# Altium schematic sheet SENSOR.SchDoc
size 420 x 297 mm; SheetNumber: 4; SheetTotal: 4
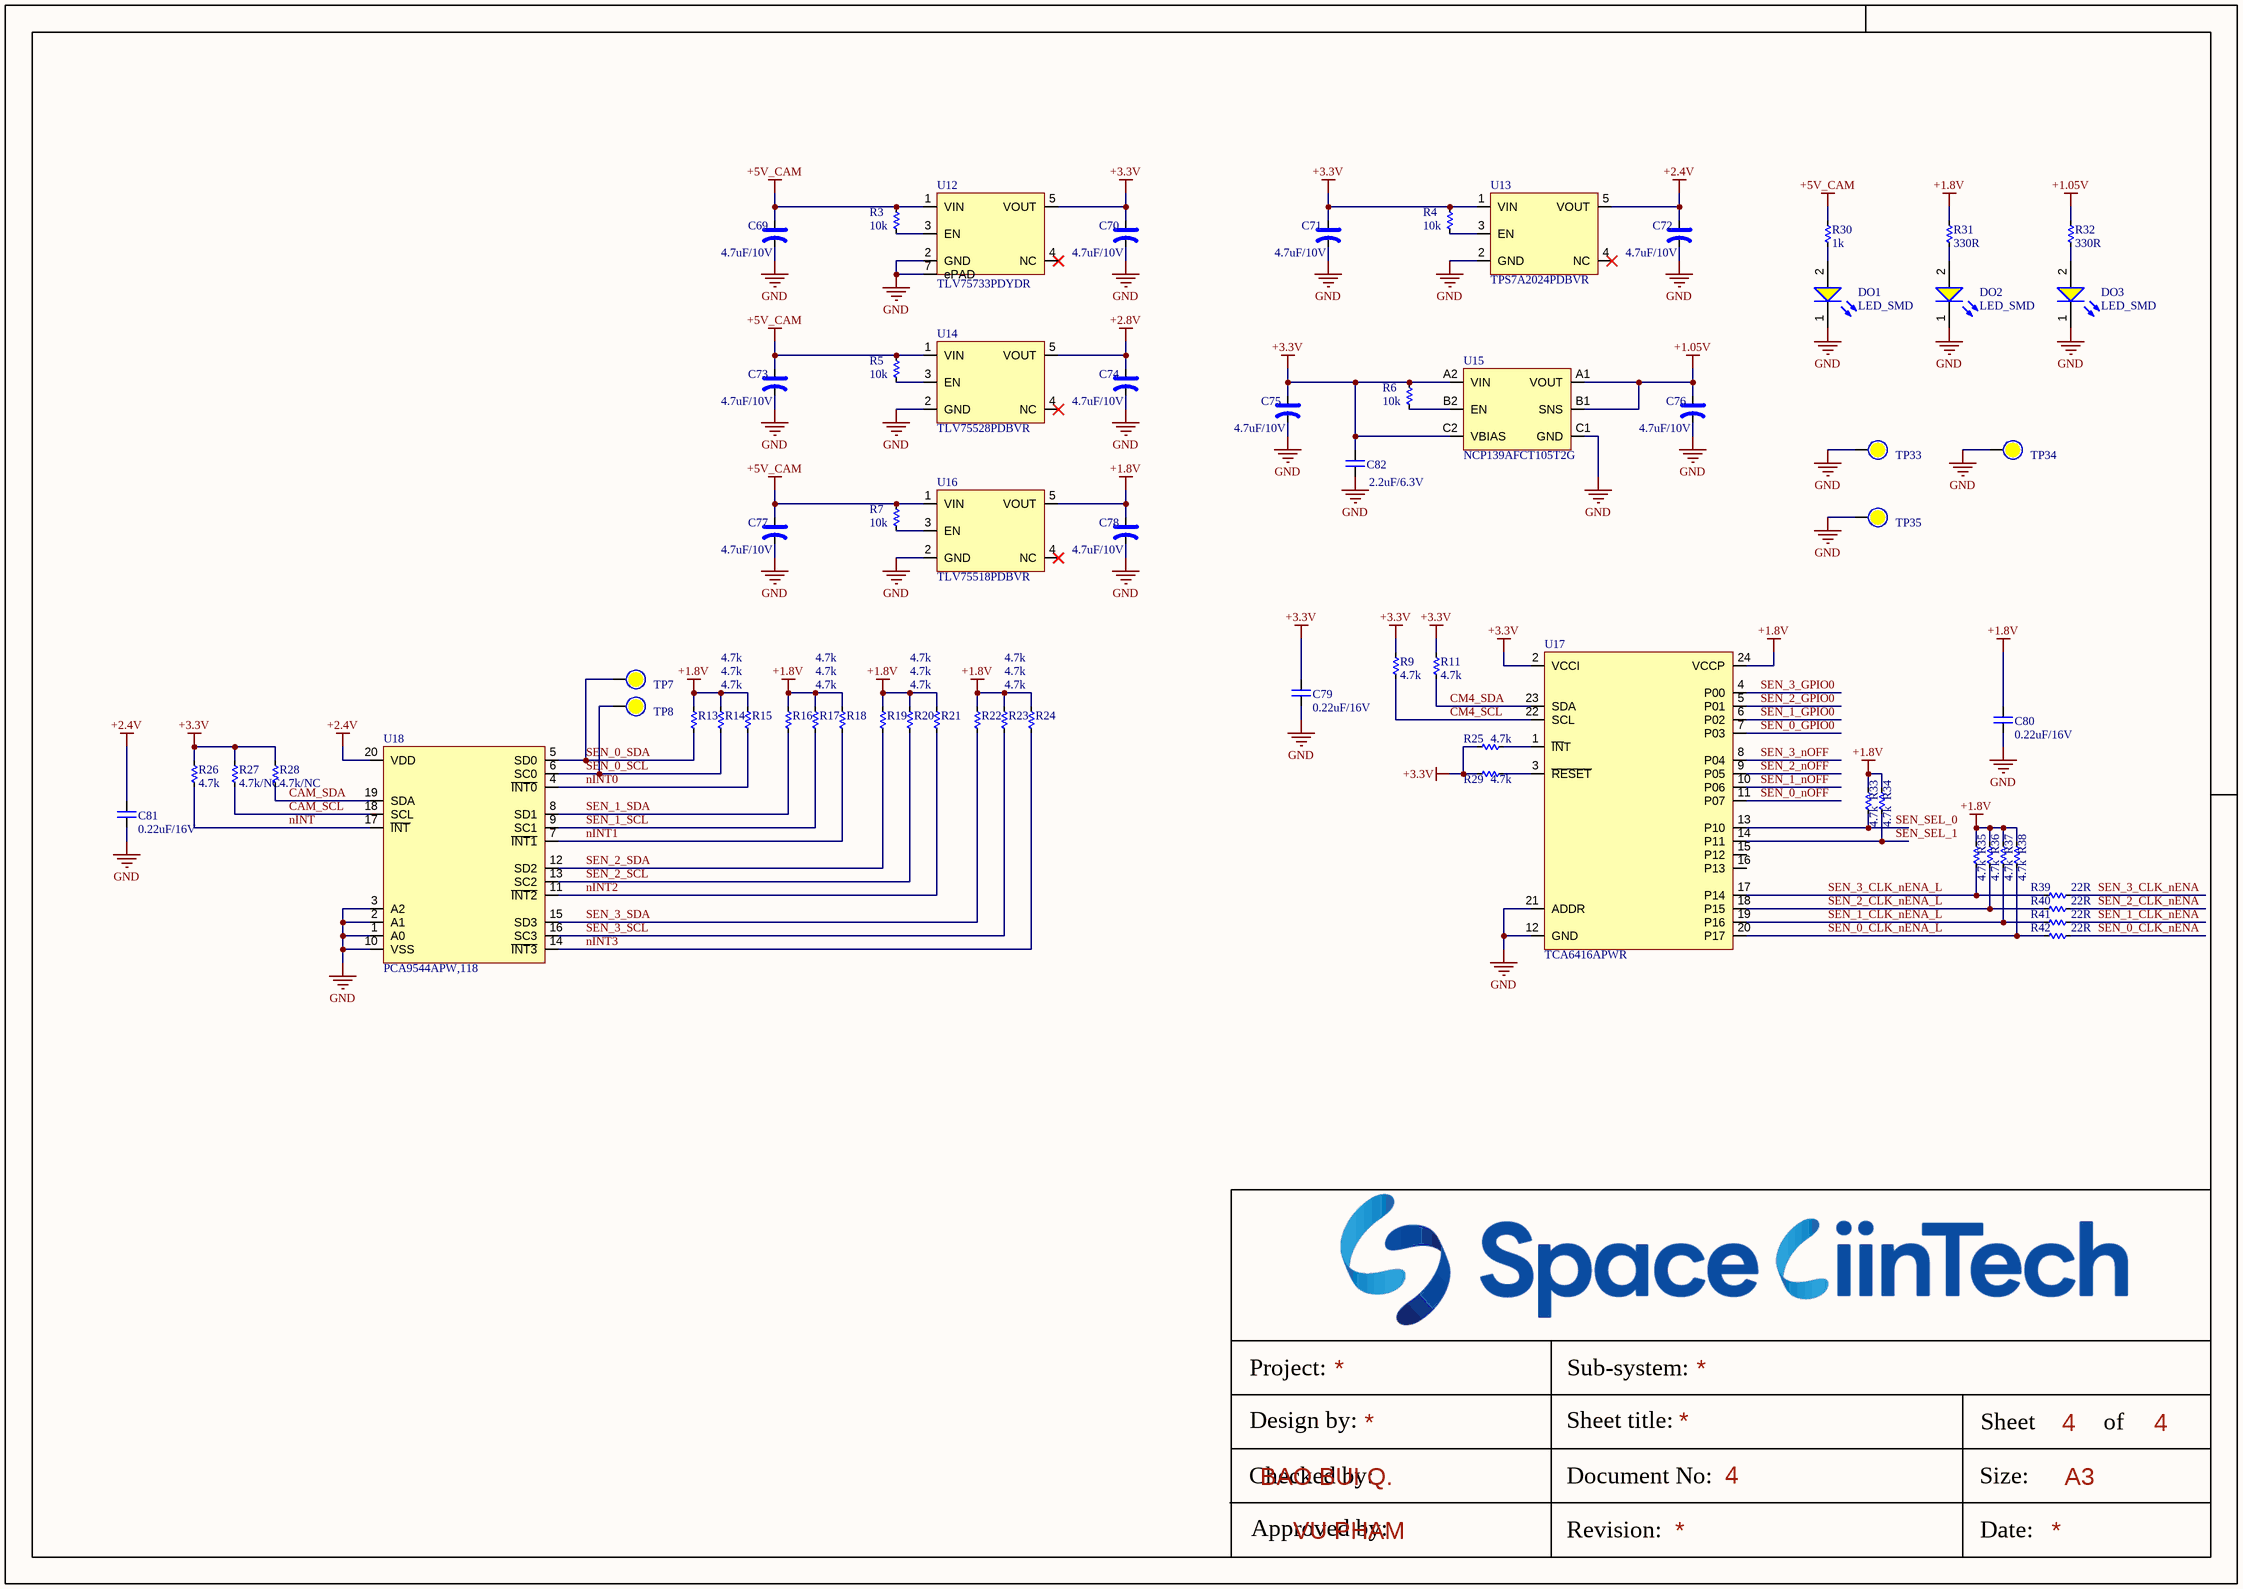
[diagram p0: SENSOR.SchDoc]

## Parts
C69  4.7uF/10V  [CAP_MP_1608X90]
C70  4.7uF/10V  [CAP_MP_1608X90]
C71  4.7uF/10V  [CAP_MP_1608X90]
C72  4.7uF/10V  [CAP_MP_1608X90]
C73  4.7uF/10V  [CAP_MP_1608X90]
C74  4.7uF/10V  [CAP_MP_1608X90]
C75  4.7uF/10V  [CAP_MP_1608X90]
C76  4.7uF/10V  [CAP_MP_1608X90]
C77  4.7uF/10V  [CAP_MP_1608X90]
C78  4.7uF/10V  [CAP_MP_1608X90]
C79  0.22uF/16V  [CAP_C_1005X60]
C80  0.22uF/16V  [CAP_C_1005X60]
C81  0.22uF/16V  [CAP_C_1005X60]
C82  2.2uF/6.3V  [CAP_C_1005X60]
DO1  LED_SMD  [LED_0603]
DO2  LED_SMD  [LED_0603]
DO3  LED_SMD  [LED_0603]
R3  10k  [RES_C_1005X40]
R4  10k  [RES_C_1005X40]
R5  10k  [RES_C_1005X40]
R6  10k  [RES_C_1005X40]
R7  10k  [RES_C_1005X40]
R9  4.7k  [RES_C_1005X40]
R11  4.7k  [RES_C_1005X40]
R13  4.7k  [RES_C_1005X40]
R14  4.7k  [RES_C_1005X40]
R15  4.7k  [RES_C_1005X40]
R16  4.7k  [RES_C_1005X40]
R17  4.7k  [RES_C_1005X40]
R18  4.7k  [RES_C_1005X40]
R19  4.7k  [RES_C_1005X40]
R20  4.7k  [RES_C_1005X40]
R21  4.7k  [RES_C_1005X40]
R22  4.7k  [RES_C_1005X40]
R23  4.7k  [RES_C_1005X40]
R24  4.7k  [RES_C_1005X40]
R25  4.7k  [RES_C_1005X40]
R26  4.7k  [RES_C_1005X40]
R27  4.7k/NC  [RES_C_1005X40]
R28  4.7k/NC  [RES_C_1005X40]
R29  4.7k  [RES_C_1005X40]
R30  1k  [RES_C_1005X40]
R31  330R  [RES_C_1005X40]
R32  330R  [RES_C_1005X40]
R33  4.7k  [RES_C_1005X40]
R34  4.7k  [RES_C_1005X40]
R35  4.7k  [RES_C_1005X40]
R36  4.7k  [RES_C_1005X40]
R37  4.7k  [RES_C_1005X40]
R38  4.7k  [RES_C_1005X40]
R39  22R  [RES_C_1005X40]
R40  22R  [RES_C_1005X40]
R41  22R  [RES_C_1005X40]
R42  22R  [RES_C_1005X40]
TP7  (no value)  [Testpoint_80]  (no BOM)
TP8  (no value)  [Testpoint_80]  (no BOM)
TP33  (no value)  [Testpoint_80]  (no BOM)
TP34  (no value)  [Testpoint_80]  (no BOM)
TP35  (no value)  [Testpoint_80]  (no BOM)
U12  TLV75733PDYDR  [SOT25-EPAD]
U13  TPS7A2024PDBVR  [SOT25]
U14  TLV75528PDBVR  [SOT25]
U15  NCP139AFCT105T2G  [WLCSP6]
U16  TLV75518PDBVR  [SOT25]
U17  TCA6416APWR  [SOP65P440W-24N]
U18  PCA9544APW,118  [SOP65P440W_20]

## Nets
+1.05V: C76.1 R32.1 U15.A1(VOUT) U15.B1(SNS)
+1.8V: C78.1 C80.2 R13.1 R14.1 R15.1 R16.1 R17.1 R18.1 R19.1 R20.1 R21.1 R22.1 R23.1 R24.1 R31.1 R33.1 R34.1 R35.1 R36.1 R37.1 R38.1 U16.5(VOUT) U17.24(VCCP)
+2.4V: C72.1 C81.2 U13.5(VOUT) U18.20(VDD)
+2.8V: C74.1 U14.5(VOUT)
+3.3V: C70.1 C71.1 C75.1 C79.2 C82.2 R4.2 R6.2 R9.1 R11.1 R25.1 R26.1 R27.1 R28.1 R29.1 U12.5(VOUT) U13.1(VIN) U15.A2(VIN) U15.C2(VBIAS) U17.2(VCCI)
+5V_CAM: C69.1 C73.1 C77.1 R3.2 R5.2 R7.2 R30.1 U12.1(VIN) U14.1(VIN) U16.1(VIN)
GND: C69.2 C70.2 C71.2 C72.2 C73.2 C74.2 C75.2 C76.2 C77.2 C78.2 C79.1 C80.1 C81.1 C82.1 DO1.1(K) DO2.1(K) DO3.1(K) TP33.0 TP34.0 TP35.0 U12.2(GND) U12.7(ePAD) U13.2(GND) U14.2(GND) U15.C1(GND) U16.2(GND) U17.12(GND) U17.21(ADDR) U18.1(A0) U18.2(A1) U18.3(A2) U18.10(VSS)
CAM_SCL: R27.2 U18.18(SCL)
CAM_SDA: R28.2 U18.19(SDA)
CM4_SCL: R9.2 U17.22(SCL)
CM4_SDA: R11.2 U17.23(SDA)
nINT: R26.2 U18.17(~{INT})
nINT0: R15.2 U18.4(~{INT0})
nINT1: R18.2 U18.7(~{INT1})
nINT2: R21.2 U18.11(~{INT2})
nINT3: R24.2 U18.14(~{INT3})
SEN_0_CLK_nENA: R42.1
SEN_0_CLK_nENA_L: R38.2 R42.2 U17.20(P17)
SEN_0_GPIO0: U17.7(P03)
SEN_0_nOFF: U17.11(P07)
SEN_0_SCL: R14.2 TP8.0 U18.6(SC0)
SEN_0_SDA: R13.2 TP7.0 U18.5(SD0)
SEN_1_CLK_nENA: R41.1
SEN_1_CLK_nENA_L: R37.2 R41.2 U17.19(P16)
SEN_1_GPIO0: U17.6(P02)
SEN_1_nOFF: U17.10(P06)
SEN_1_SCL: R17.2 U18.9(SC1)
SEN_1_SDA: R16.2 U18.8(SD1)
SEN_2_CLK_nENA: R40.1
SEN_2_CLK_nENA_L: R36.2 R40.2 U17.18(P15)
SEN_2_GPIO0: U17.5(P01)
SEN_2_nOFF: U17.9(P05)
SEN_2_SCL: R20.2 U18.13(SC2)
SEN_2_SDA: R19.2 U18.12(SD2)
SEN_3_CLK_nENA: R39.1
SEN_3_CLK_nENA_L: R35.2 R39.2 U17.17(P14)
SEN_3_GPIO0: U17.4(P00)
SEN_3_nOFF: U17.8(P04)
SEN_3_SCL: R23.2 U18.16(SC3)
SEN_3_SDA: R22.2 U18.15(SD3)
SEN_SEL_0: R33.2 U17.13(P10)
SEN_SEL_1: R34.2 U17.14(P11)
NetDO1_2: DO1.2(A) R30.2
NetDO2_2: DO2.2(A) R31.2
NetDO3_2: DO3.2(A) R32.2
NetR3_1: R3.1 U12.3(EN)
NetR4_1: R4.1 U13.3(EN)
NetR5_1: R5.1 U14.3(EN)
NetR6_1: R6.1 U15.B2(EN)
NetR7_1: R7.1 U16.3(EN)
NetR25_2: R25.2 U17.1(~{IN}T)
NetR29_2: R29.2 U17.3(~{RESET})

Not connected (* = marked no-connect by the designer): U12 4(NC)*; U13 4(NC)*; U14 4(NC)*; U16 4(NC)*; U17 15(P12) 16(P13)

## Notes on the sheet
- Project:
- Sub-system:
- Design by:
- BAO BUI Q.
- Sheet title:
- Sheet
- A3
- of
- Checked by:
- Approved by:
- VU PHAM
- Revision:
- Document No:
- Size:
- Date:

## Library data of the parts
C69-C78 = CAP_TH: CAP_Polarization; Published: 8-Jun-2000; LatestRevisionDate: 17-Jul-2002; LatestRevisionNote: Re-released for DXP Platform.; PackageReference: POLAR0.8; Publisher: Altium Limited
C79-C82 = CAP_SMD: CAP_Chip; Value: 33pF
R3-R7 R9 R11 R13-R42 = RES-SMD: RES-Chip; Manufacturer: Generic Components; Class: Passive; Published: 08/06/2000; Publisher: Altium Hobart Technology Centre
TP7 TP8 TP33-TP35 = Test Point: Solder: NF
U12 = IC_POWER_TLV75733PDYDR
U13 U14 U16 = IC_POWER_AP7347DQ
U15 = IC_POWER_NCP139AFCT105T2G
U17 = IC_I2Cto16IO_TCA6416APWR
U18 = IC_I2CSW1to4_PCA9544APW,118